# EasyEDA schematic 2022-11-04 ESP32-Cseries Riser v1.0.json
TITLE: Sheet_1; REV: 1.0; Date: 2022-11-01; Sheet: 1/1; Drawn By: kpoole; Company: Your Company
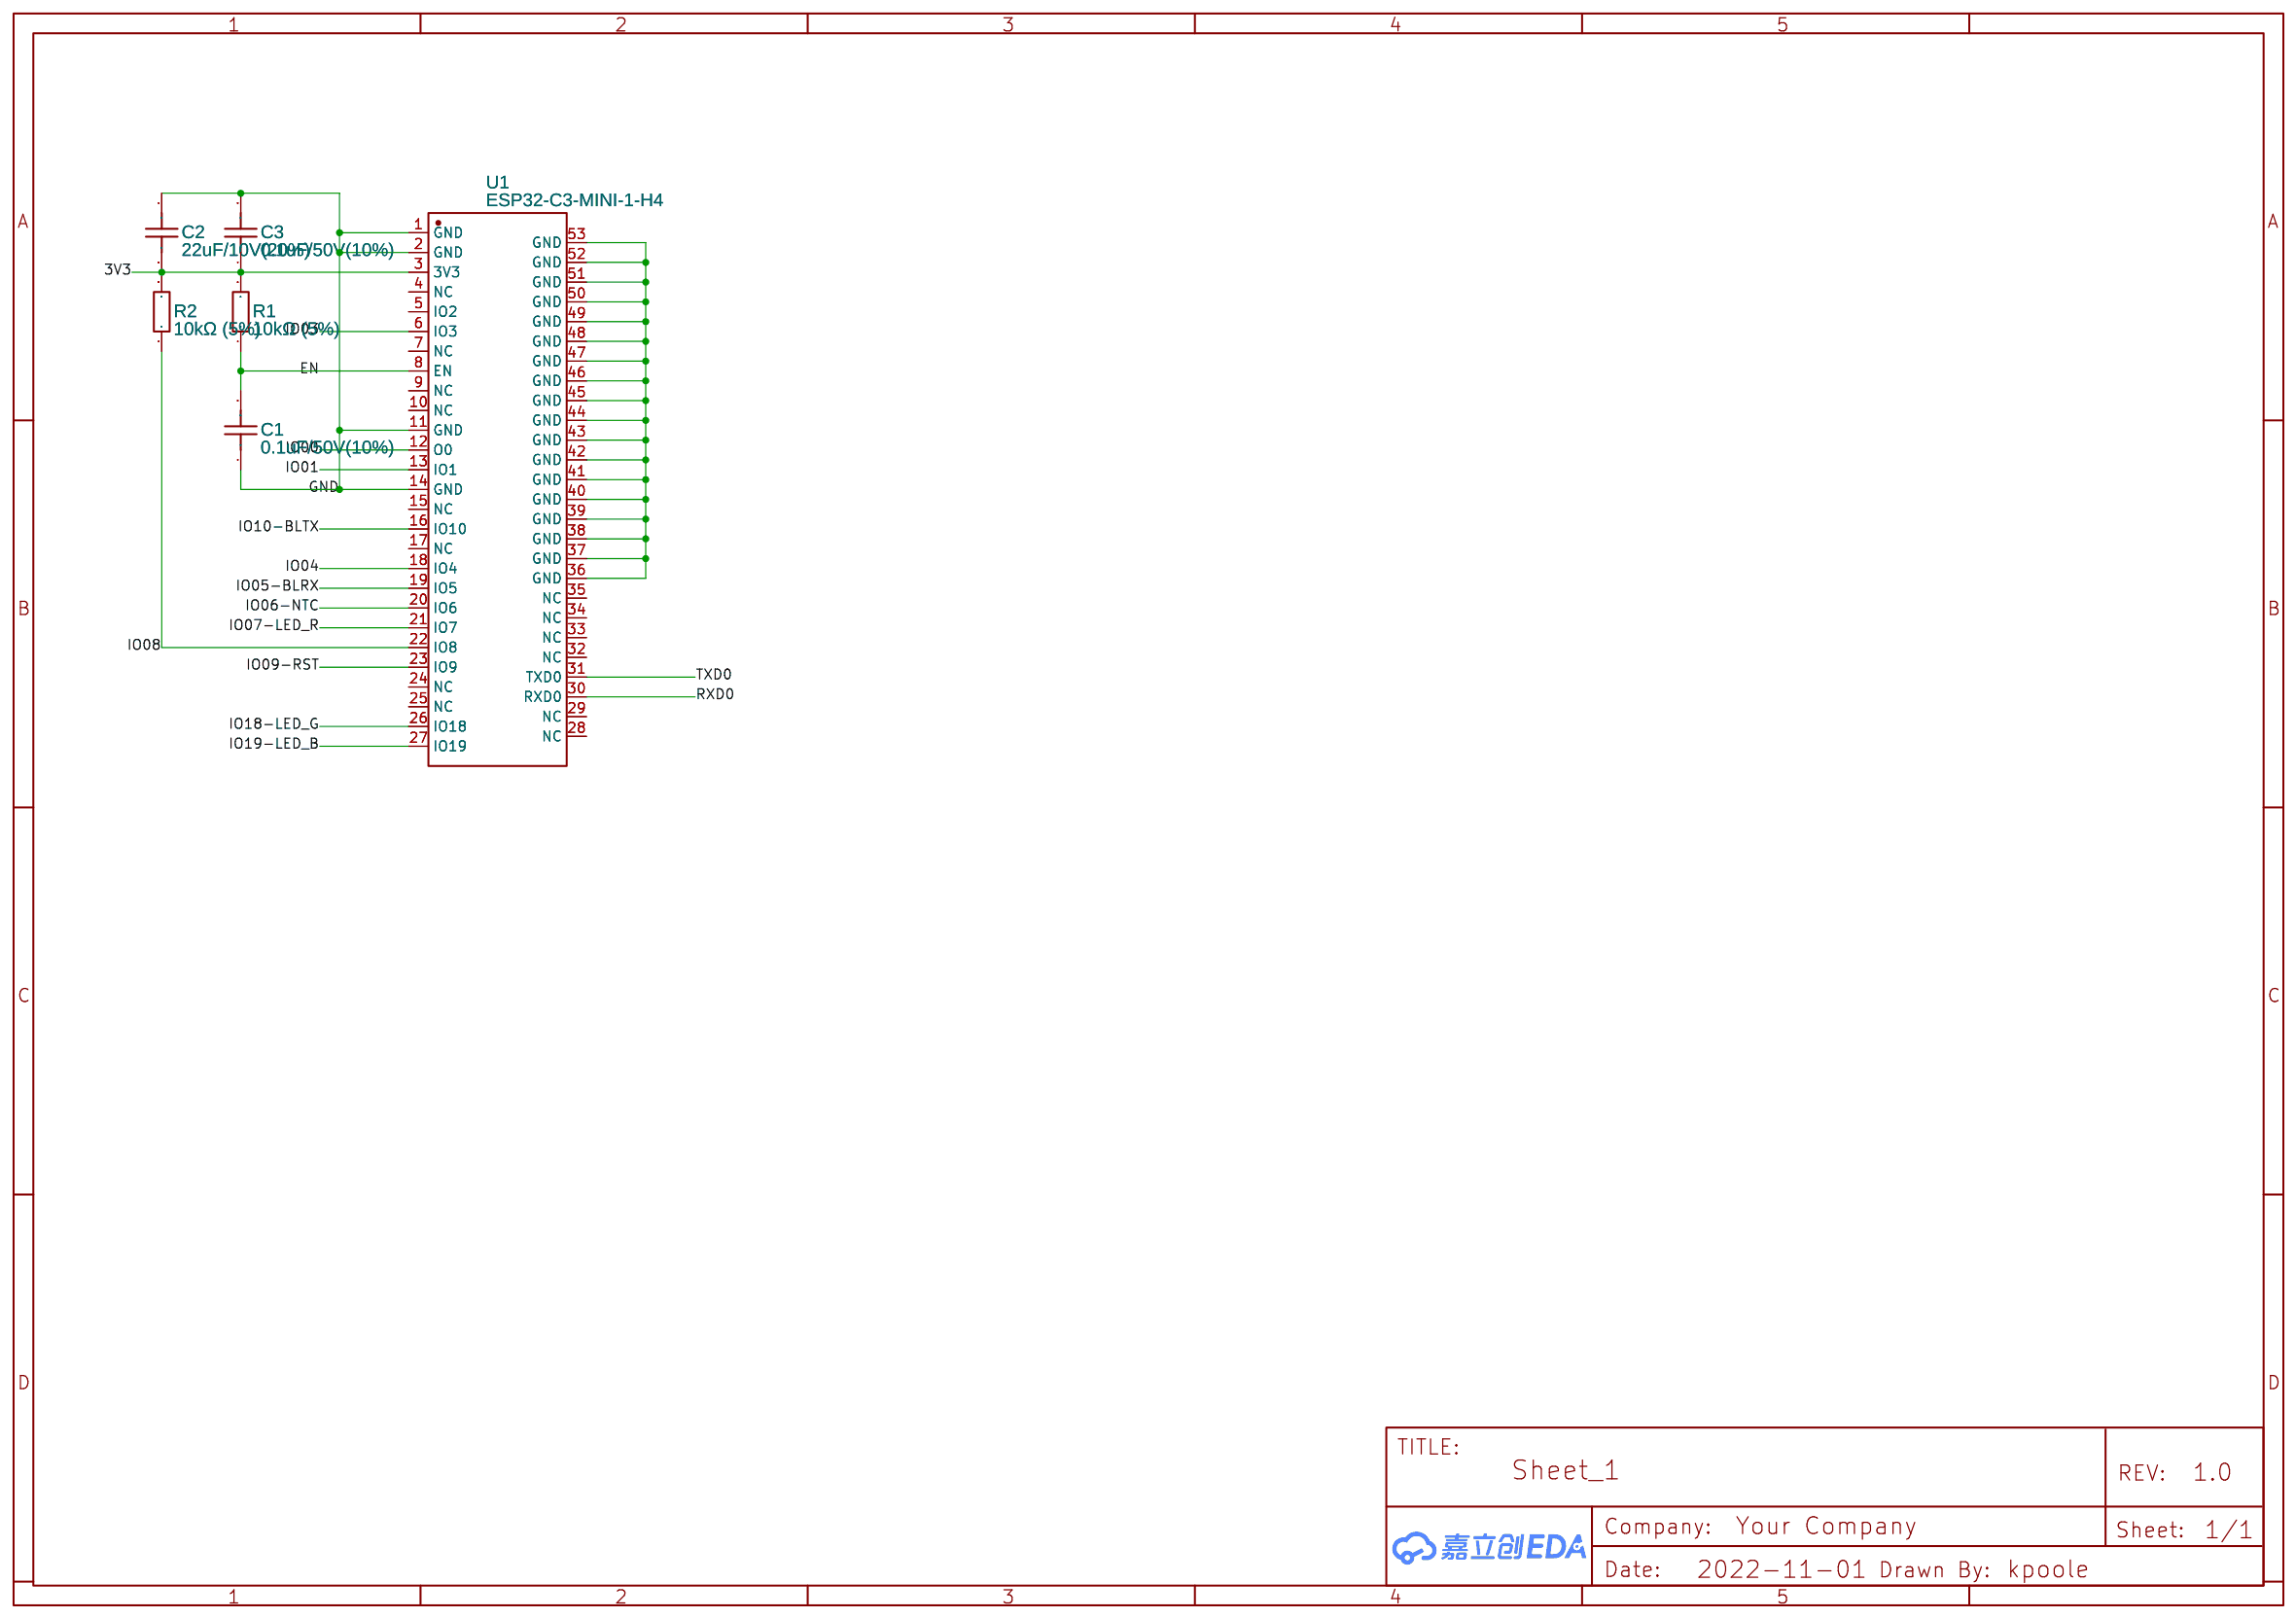
[diagram p0: schematic sheet]

## Parts
C1  0.1uF/50V(10%)  [C0603]
C2  22uF/10V(20%)  [C0603]
C3  0.1uF/50V(10%)  [C0603]
R1  10kΩ (5%)  [R0805]
R2  10kΩ (5%)  [R0805]
U1  ESP32-C3-MINI-1-H4  [WIFIM-SMD_ESP32-C3-MINI-1]

## Library data of the parts
C1 = 0603BB104K500NGT: Supplier: LCSC; Supplier Part: C2168571; Manufacturer: Knowles(楼氏); Contributor: LCSC; JLCPCB Part Class: Extended Part
C2 = CL10A226MP8NUNE: Supplier: LCSC; Manufacturer: SAMSUNG; Supplier Part: C86295; JLCPCB Part Class: Extended Part
C3 = CAP-SMD-0603-10UF-50V-10%: Supplier: LCSC; Supplier Part: C9900006127; Manufacturer: null; Manufacturer Part: CAP-SMD-0603-10uF-50V-10%; JLCPCB Part Class: Extended Part; Contributor: LCSC
R1 R2 = RK73B2ATTD103J: Supplier: LCSC; Manufacturer: KOA; Resistance (Ohms): 10K; Contributor: LCSC; Supplier Part: C159912; JLCPCB Part Class: Extended Part
U1 = ESP32-C3-MINI-1-H4: Supplier: LCSC; Supplier Part: C2935306; Manufacturer: 乐鑫信息科技; JLCPCB Part Class: Extended Part; Contributor: LCSC

## Nets
3V3: C2.2 C3.1 R1.2 R2.2 U1.3(3V3)
GND: C1.1 C2.1 C3.2 U1.1(GND) U1.2(GND) U1.11(GND) U1.14(GND)
EN: C1.2 R1.1 U1.8(EN)
IO00: U1.12(O0)
IO01: U1.13(IO1)
IO03: U1.6(IO3)
IO04: U1.18(IO4)
IO05-BLRX: U1.19(IO5)
IO06-NTC: U1.20(IO6)
IO07-LED_R: U1.21(IO7)
IO08: R2.1 U1.22(IO8)
IO09-RST: U1.23(IO9)
IO10-BLTX: U1.16(IO10)
IO18-LED_G: U1.26(IO18)
IO19-LED_B: U1.27(IO19)
RXD0: U1.30(RXD0)
TXD0: U1.31(TXD0)
Net-(U1-36): U1.36(GND) U1.37(GND) U1.38(GND) U1.39(GND) U1.40(GND) U1.41(GND) U1.42(GND) U1.43(GND) U1.44(GND) U1.45(GND) U1.46(GND) U1.47(GND) U1.48(GND) U1.49(GND) U1.50(GND) U1.51(GND) U1.52(GND) U1.53(GND)

Not connected (* = marked no-connect by the designer): U1 4(NC) 5(IO2) 7(NC) 9(NC) 10(NC) 15(NC) 17(NC) 24(NC) 25(NC) 28(NC) 29(NC) 32(NC) 33(NC) 34(NC) 35(NC)
